# Altium project uStepperSlite.PrjPcb
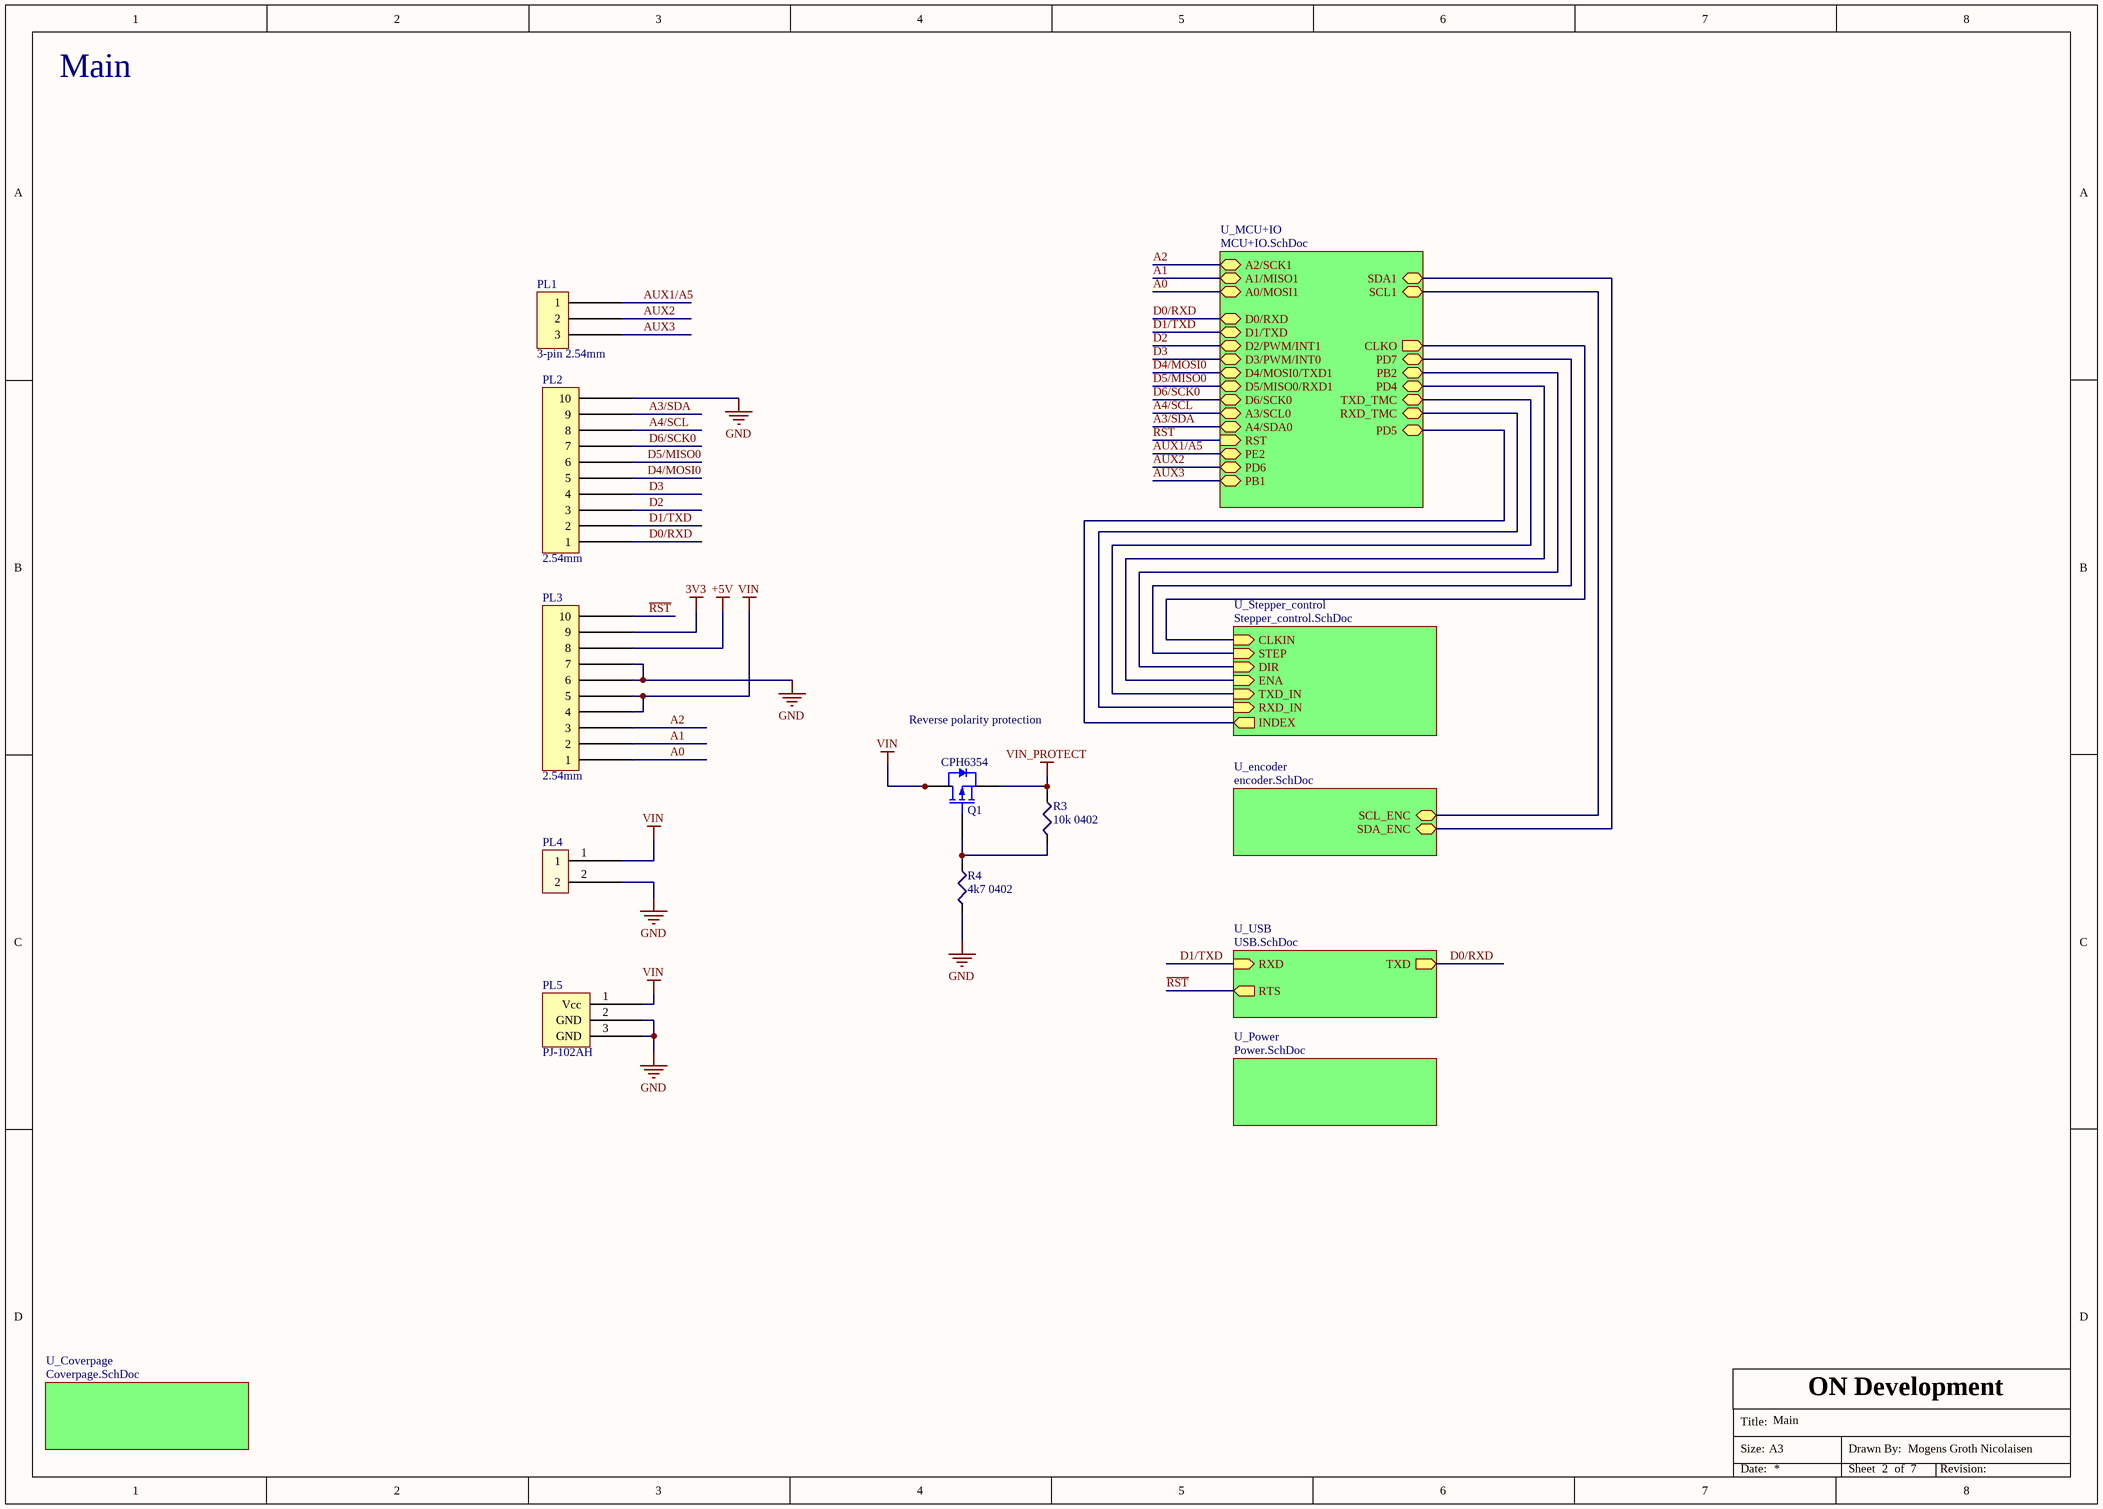
[diagram p0: Main.SchDoc]
GlobalCompanyName: ON Development; GlobalDrawnBy: Mogens Groth Nicolaisen; GlobalProjectName: uStepper S-lite; GlobalProjectRevision: 1.0
7 sheets, 84 parts. Net scope: hierarchical (ports join the sheet entries above them; power ports are global).
Board file: uStepper.PcbDoc
Sheets:
  Main.SchDoc
    U_Power = Power.SchDoc
    U_USB = USB.SchDoc
    U_Coverpage = Coverpage.SchDoc
    U_MCU+IO = MCU+IO.SchDoc
    U_Stepper_control = Stepper_control.SchDoc
    U_encoder = encoder.SchDoc

## Sheet Main.SchDoc: Main
size A3; DrawnBy: Mogens Groth Nicolaisen; DocumentNumber: 2; Revision: 1.0; SheetNumber: 2; SheetTotal: 7

### Parts
PL1  3-pin 2.54mm  [3-pin 2.54mm header]
PL2  2.54mm  [10-pin female 2.54mm]
PL3  2.54mm  [10-pin female 2.54mm]
PL4  2pin Terminal block 5.08mm  [5mm header]  (value not drawn)
PL5  PJ-102AH  [PJ-102AH]
Q1  CPH6354  [SOT95P280X95-6N]
R3  10k 0402  [RES_0402]
R4  4k7 0402  [RES_0402]

### Sub-sheets
U_Coverpage = Coverpage.SchDoc: no entries
U_encoder = encoder.SchDoc: SDA_ENC (bidir), SCL_ENC (bidir)
U_MCU+IO = MCU+IO.SchDoc: A2/SCK1 (bidir), A1/MISO1 (bidir), A0/MOSI1 (bidir), D1/TXD (bidir), D0/RXD (bidir), PB2 (bidir), CLKO (out), A4/SDA0 (bidir), A3/SCL0 (bidir), D3/PWM/INT0 (bidir), D2/PWM/INT1 (bidir), PD4 (bidir), PB1 (bidir), RST (in), TXD_TMC (bidir), RXD_TMC (bidir), SCL1 (bidir), D5/MISO0/RXD1 (bidir), D4/MOSI0/TXD1 (bidir), SDA1 (bidir), D6/SCK0 (bidir), PE2 (bidir), PD5 (bidir), PD6 (bidir), PD7 (bidir)
U_Power = Power.SchDoc: no entries
U_Stepper_control = Stepper_control.SchDoc: STEP (in), DIR (in), ENA (in), CLKIN (in), TXD_IN (in), RXD_IN (in), INDEX (out)
U_USB = USB.SchDoc: RXD (in), TXD (out), RTS (out)

### Nets
3V3: PL3.9
+5V: PL3.8
GND: PL2.10 PL3.6 PL3.7 PL4.2 PL5.2(GND) PL5.3(GND) R4.1
VIN: PL3.4 PL3.5 PL4.1 PL5.1(Vcc) Q1.1(DRAIN) Q1.2(DRAIN) Q1.5(DRAIN) Q1.6(DRAIN)
VIN_PROTECT: Q1.4(SOURCE) R3.2
~{RST}: PL3.10 ; sheet U_USB/RTS, sheet U_MCU+IO/RST
A0: PL3.1 ; sheet U_MCU+IO/A0/MOSI1
A1: PL3.2 ; sheet U_MCU+IO/A1/MISO1
A2: PL3.3 ; sheet U_MCU+IO/A2/SCK1
A3/SDA: PL2.9 ; sheet U_MCU+IO/A4/SDA0
A4/SCL: PL2.8 ; sheet U_MCU+IO/A3/SCL0
AUX1/A5: PL1.1 ; sheet U_MCU+IO/PE2
AUX2: PL1.2 ; sheet U_MCU+IO/PD6
AUX3: PL1.3 ; sheet U_MCU+IO/PB1
CLKIN: sheet U_MCU+IO/CLKO, sheet U_Stepper_control/CLKIN
D0/RXD: PL2.1 ; sheet U_USB/TXD, sheet U_MCU+IO/D0/RXD
D1/TXD: PL2.2 ; sheet U_USB/RXD, sheet U_MCU+IO/D1/TXD
D2: PL2.3 ; sheet U_MCU+IO/D2/PWM/INT1
D3: PL2.4 ; sheet U_MCU+IO/D3/PWM/INT0
D4/MOSI0: PL2.5 ; sheet U_MCU+IO/D4/MOSI0/TXD1
D5/MISO0: PL2.6 ; sheet U_MCU+IO/D5/MISO0/RXD1
D6/SCK0: PL2.7 ; sheet U_MCU+IO/D6/SCK0
DIR: sheet U_MCU+IO/PB2, sheet U_Stepper_control/DIR
ENA: sheet U_MCU+IO/PD4, sheet U_Stepper_control/ENA
INDEX: sheet U_MCU+IO/PD5, sheet U_Stepper_control/INDEX
PD7: sheet U_MCU+IO/PD7, sheet U_Stepper_control/STEP
RXD_IN: sheet U_MCU+IO/RXD_TMC, sheet U_Stepper_control/RXD_IN
SCL1: sheet U_MCU+IO/SCL1, sheet U_encoder/SCL_ENC
SDA1: sheet U_MCU+IO/SDA1, sheet U_encoder/SDA_ENC
TXD_IN: sheet U_MCU+IO/TXD_TMC, sheet U_Stepper_control/TXD_IN
NetQ1_3: Q1.3(GATE) R3.1 R4.2

### Notes on the sheet
- Reverse polarity protection
- ON Development
- Title:
- Size:
- A3
- Drawn By:
- Date:
- Sheet
- of
- Revision:

### Library data of the parts
PL1 = CMP-003-0018-1: Pin header 3-pin 2.54mm male; Mfg. Part Number: DS1021-1*3SF1-1; DynamicData: Ningbo Connfly Electric DS1021-1*3SF1-1; Cat: Connectors; LatestRevision: 1; FootprintName1: 3-pin 2.54mm header; FootprintRevisionID1: PCC-0050-2
PL2 PL3 = CMP-003-0004-2: Pin header 10-pin 2.54mm female; Mfg. Part Number: DS1023-1*10S21
PL4 = CMP-003-0002-2: PCB terminal block, angled 90°; 5mm, 2-way, 1.5mm2; Mfg. Part Number: DG301-5.0-02P-11-00A(H)
PL5 = CMP-003-0001-3: CONN PWR JACK 2X5.5MM SOLDER; Mfg. Part Number: PJ-102AH
Q1 = CMP-014-0006-2: MOSFET P-CH 60V 4A CPH6; Mfg. Part Number: CPH6354-TL-W
R3 = CMP-001-0019-3: RES SMD 10K OHM 1% 1/16W 0402; Mfg. Part Number: RMCF0402FT10K0; Case/Package: 0402; Power: 1/16 W; Tolerance: 1 %; Value: 10k
R4 = CMP-001-0029-3: RES SMD 4.7K OHM 1% 1/16W 0402; Mfg. Part Number: RC1005F472CS; Tolerance: 1; Case/Package: 0402; Power: 1/16W; Value: 4k7

## Sheet Power.SchDoc: Power
size A3; DrawnBy: Mogens Groth Nicolaisen; DocumentNumber: 5; Revision: 1.0; SheetNumber: 5; SheetTotal: 7
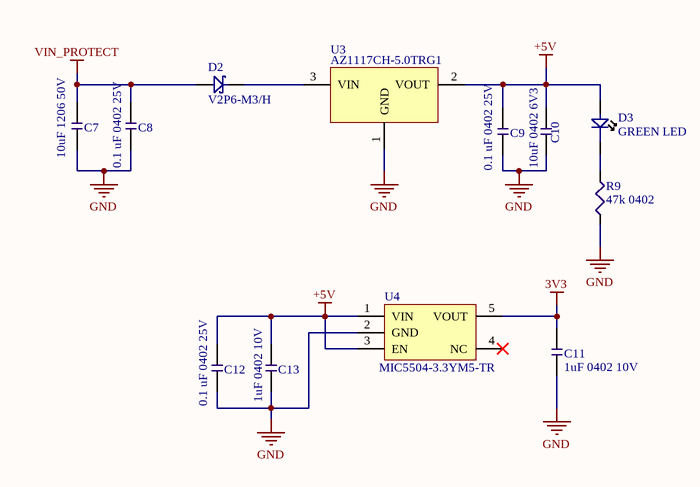
[diagram p1: Power.SchDoc]

### Parts
C7  10uF 1206 50V  [CAP_1206]
C8  0.1 uF 0402 25V  [CAP_0402]
C9  0.1 uF 0402 25V  [CAP_0402]
C10  10uF 0402 6V3  [CAP_0402]
C11  1uF 0402 10V  [CAP_0402]
C12  0.1 uF 0402 25V  [CAP_0402]
C13  1uF 0402 10V  [CAP_0402]
D2  V2P6-M3/H  [MicroSMP]
D3  GREEN LED  [0402 LED]
R9  47k 0402  [RES_0402]
U3  AZ1117CH-5.0TRG1  [SOT230P700X180-4N]
U4  MIC5504-3.3YM5-TR  [SOT95P280X130-5N]

### Nets
3V3: C11.2 U4.5(VOUT)
+5V: C9.2 C10.2 C12.2 C13.2 D3.1 U3.2(VOUT) U4.1(VIN) U4.3(EN)
GND: C7.1 C8.1 C9.1 C10.1 C11.1 C12.1 C13.1 R9.1 U3.1(GND) U4.2(GND)
VIN_PROTECT: C7.2 C8.2 D2.1
NetD2_2: D2.2 U3.3(VIN)
NetD3_2: D3.2 R9.2

Not connected (* = marked no-connect by the designer): U4 4(NC)*

### Notes on the sheet
- ON Development
- Title:
- Size:
- A3
- Drawn By:
- Date:
- Sheet
- of
- Revision:

### Library data of the parts
C7 = CMP-00030-4: 10uF 1206 50V X5R 20%; Tolerance: +/- 20%; Value: 10uF; Voltage: 50 V
C8 C9 C12 = CMP-00061-4: 0.1UF 25V 10% X5R 0402; Mfg. Part Number: TMK105BJ104KV-F; Tolerance: 10%; Value: 0.1 uF; Voltage: 25V
C10 = CMP-00011-3: 10uF 20% 0402 6V3 X6S; Current Rating: -; Tolerance: 20%; Value: 10uF; Voltage: 6V3
C11 C13 = CMP-00032-4: 1uF 0402 10V 10% X5R; Tolerance: 10 %; Value: 1 uF; Voltage: 10 V
D2 = CMP-016-0002-2: DIODE SCHOTTKY 60V 2A MICROSMP
D3 = CMP-008-0001-2: 0402 SMD LED; Mfg. Part Number: LTST-C281KGKT
R9 = CMP-001-0027-3: RES SMD 47K OHM 1% 1/16W 0402; Mfg. Part Number: RMCF0402FT47K0; Case/Package: 0402; Power: 1/16W; Tolerance: 1%; Value: 47k
U3 = CMP-00060-4: IC REG LINEAR 5V 800MA SOT223; Mfg. Part Number: AZ1117CH-5.0TRG1
U4 = CMP-00031-4: LDO Voltage Regulators Single 300mA

## Sheet USB.SchDoc: USB interface
size A3; DrawnBy: Mogens Groth Nicolaisen; DocumentNumber: 6; Revision: 1.0; SheetNumber: 6; SheetTotal: 7
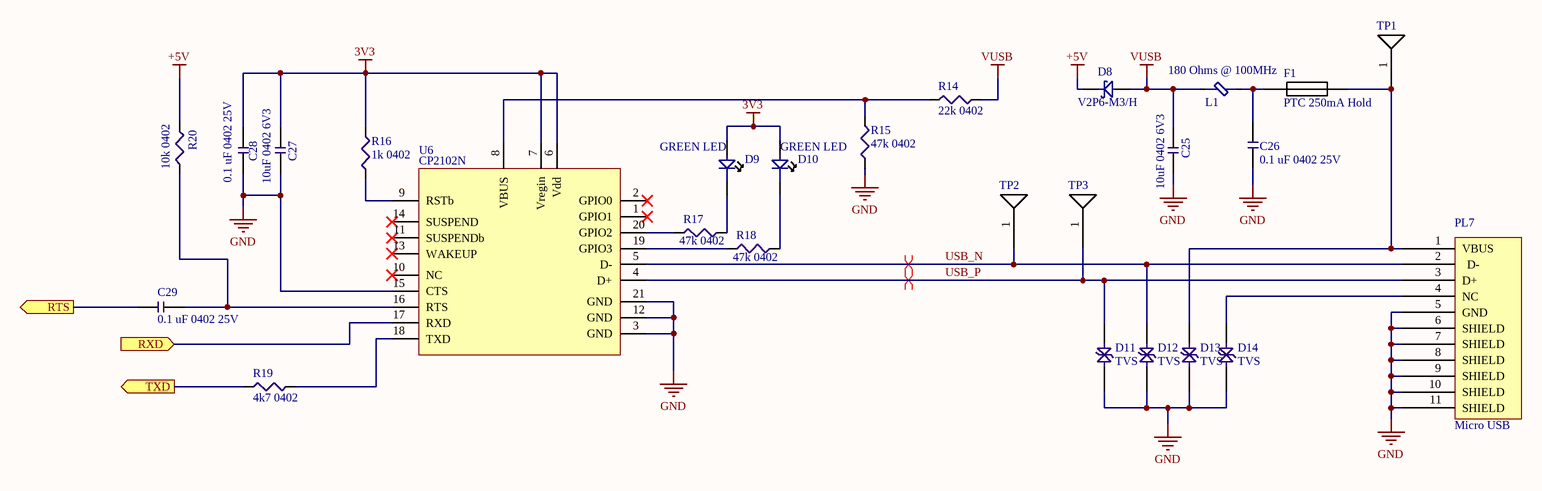
[diagram p2: USB.SchDoc]

### Parts
C25  10uF 0402 6V3  [CAP_0402]
C26  0.1 uF 0402 25V  [CAP_0402]
C27  10uF 0402 6V3  [CAP_0402]
C28  0.1 uF 0402 25V  [CAP_0402]
C29  0.1 uF 0402 25V  [CAP_0402]
D8  V2P6-M3/H  [MicroSMP]
D9  GREEN LED  [0402 LED]
D10  GREEN LED  [0402 LED]
D11  TVS  [RES_0402]
D12  TVS  [RES_0402]
D13  TVS  [RES_0402]
D14  TVS  [RES_0402]
F1  PTC 250mA Hold  [PTC Fuse 1206]
L1  180 Ohms @ 100MHz  [IND_0603]
PL7  Micro USB  [10118193-0001LF Micro USB]
R14  22k 0402  [RES_0402]
R15  47k 0402  [RES_0402]
R16  1k 0402  [RES_0402]
R17  47k 0402  [RES_0402]
R18  47k 0402  [RES_0402]
R19  4k7 0402  [RES_0402]
R20  10k 0402  [RES_0402]
TP1  TestPoint  [1x0mm]  (value not drawn)  (no BOM)
TP2  TestPoint  [1x0mm]  (value not drawn)  (no BOM)
TP3  TestPoint  [1x0mm]  (value not drawn)  (no BOM)
U6  CP2102N  [QFN50P300X300X80_HS-21N]

### Ports
RTS (out), RXD (in), TXD (out)

### Nets
3V3: C27.2 C28.2 D9.1 D10.1 R16.2 U6.6(Vdd) U6.7(Vregin)
+5V: D8.2 R20.2
GND: C25.1 C26.1 C27.1 C28.1 D11.1(Anode) D12.1(Anode) D13.1(Anode) D14.1(Anode) PL7.5(GND) PL7.6(SHIELD) PL7.7(SHIELD) PL7.8(SHIELD) PL7.9(SHIELD) PL7.10(SHIELD) PL7.11(SHIELD) R15.1 U6.3(GND) U6.12(GND) U6.15(CTS) U6.21(GND)
VUSB: C25.2 D8.1 L1.1 R14.2
~{RST}: C29.2 ; port RTS
D0/RXD: R19.2 ; port TXD
D1/TXD: U6.17(RXD) ; port RXD
USB_N: D12.2(Cathode) PL7.2(D-) TP2.1 U6.5(D-)
USB_P: D11.2(Cathode) PL7.3(D+) TP3.1 U6.4(D+)
NetC26_2: C26.2 F1.1 L1.2
NetC29_1: C29.1 R20.1 U6.16(RTS)
NetD9_2: D9.2 R17.1
NetD10_2: D10.2 R18.1
NetD13_2: D13.2(Cathode) F1.2 PL7.1(VBUS) TP1.1
NetD14_2: D14.2(Cathode) PL7.4(NC)
NetR14_1: R14.1 R15.2 U6.8(VBUS)
NetR16_1: R16.1 U6.9(RSTb)
NetR17_2: R17.2 U6.20(GPIO2)
NetR18_2: R18.2 U6.19(GPIO3)
NetR19_1: R19.1 U6.18(TXD)

Not connected (* = marked no-connect by the designer): U6 1(GPIO1)* 2(GPIO0)* 10(NC)* 11(SUSPENDb)* 13(WAKEUP)* 14(SUSPEND)*

### Layout directives
differential pair: USB_N, USB_P

### Notes on the sheet
- ON Development
- Title:
- Size:
- A3
- Drawn By:
- Date:
- Sheet
- of
- Revision:

### Library data of the parts
C25 C27 = CMP-00011-3: 10uF 20% 0402 6V3 X6S; Current Rating: -; Tolerance: 20%; Value: 10uF; Voltage: 6V3
C26 C28 C29 = CMP-00061-4: as C8 on sheet Power; Tolerance: 10%; Value: 0.1 uF; Voltage: 25V
D8 = CMP-016-0002-2: DIODE SCHOTTKY 60V 2A MICROSMP
D9 D10 = CMP-008-0001-2: as D3 on sheet Power
D11-D14 = CMP-016-0004-2: TVS DIODE 12VC 8A IPP 0402; Mfg. Part Number: GG040205100N2P
F1 = CMP-017-0000-3: PTC RESET FUSE 24V 250MA 1206; Mfg. Part Number: 0ZCJ0025AF2E; Case/Package: 1206; Mount: SMD; Pins: 2; RoHS: Yes
L1 = CMP-ROOT-0005-2: FERRITE BEAD 180 OHM 0603 1LN; Mfg. Part Number: BLM18PG181SN1D; Current: 1.5A; Value: 180 Ohm; Case/Package: 0603
PL7 = CMP-003-0000-3: CONN USB MICRO B RECPT SMT R/A; Mfg. Part Number: 10118193-0001LF
R14 = CMP-001-0026-3: RES SMD 22K OHM 1% 1/16W 0402; Mfg. Part Number: RMCF0402FT22K0; Case/Package: 0402; Power: 1/16W; Tolerance: 1%; Value: 22k
R15 R17 R18 = CMP-001-0027-3: as R9 on sheet Power; Case/Package: 0402; Power: 1/16W; Tolerance: 1%; Value: 47k
R16 = CMP-001-0025-3: RES SMD 1K OHM 1% 1/16W 0402; Mfg. Part Number: CRG0402F1K0; Case/Package: 0402; Power: 1/16W; Tolerance: 1%; Value: 1k
R19 = CMP-001-0029-3: as R4 on sheet Main; Case/Package: 0402; Power: 1/16W; Value: 4k7
R20 = CMP-001-0019-3: as R3 on sheet Main; Case/Package: 0402; Power: 1/16 W; Tolerance: 1 %; Value: 10k
TP1-TP3 = CMP-ROOT-0006-0.0
U6 = CMP-00038-5: IC BRIDGE USB TO UART 20QFN; Mfg. Part Number: CP2102N-A01-GQFN20

## Sheet Coverpage.SchDoc: uStepper S-lite
size A3; DrawnBy: Mogens Groth Nicolaisen; DocumentNumber: 1; Revision: 1.0; SheetNumber: 1; SheetTotal: 7
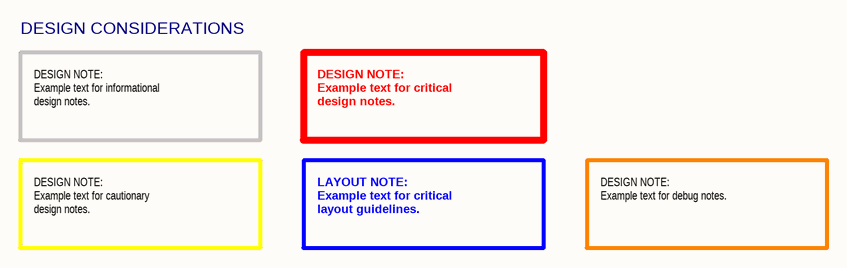
[diagram p3: Coverpage.SchDoc]

### Notes on the sheet
- DESIGN CONSIDERATIONS
- DESIGN NOTE:
  Example text for informational
  design notes.
- DESIGN NOTE:
  Example text for critical
  design notes.
- DESIGN NOTE:
  Example text for cautionary
  design notes.
- LAYOUT NOTE:
  Example text for critical
  layout guidelines.
- DESIGN NOTE:
  Example text for debug notes.
- ON Development
- Title:
- Size:
- A3
- Drawn By:
- Date:
- Sheet
- of
- Revision:

## Sheet MCU+IO.SchDoc: MCU
size A3; DrawnBy: Mogens Groth Nicolaisen; DocumentNumber: 3; Revision: 1.0; SheetNumber: 3; SheetTotal: 7
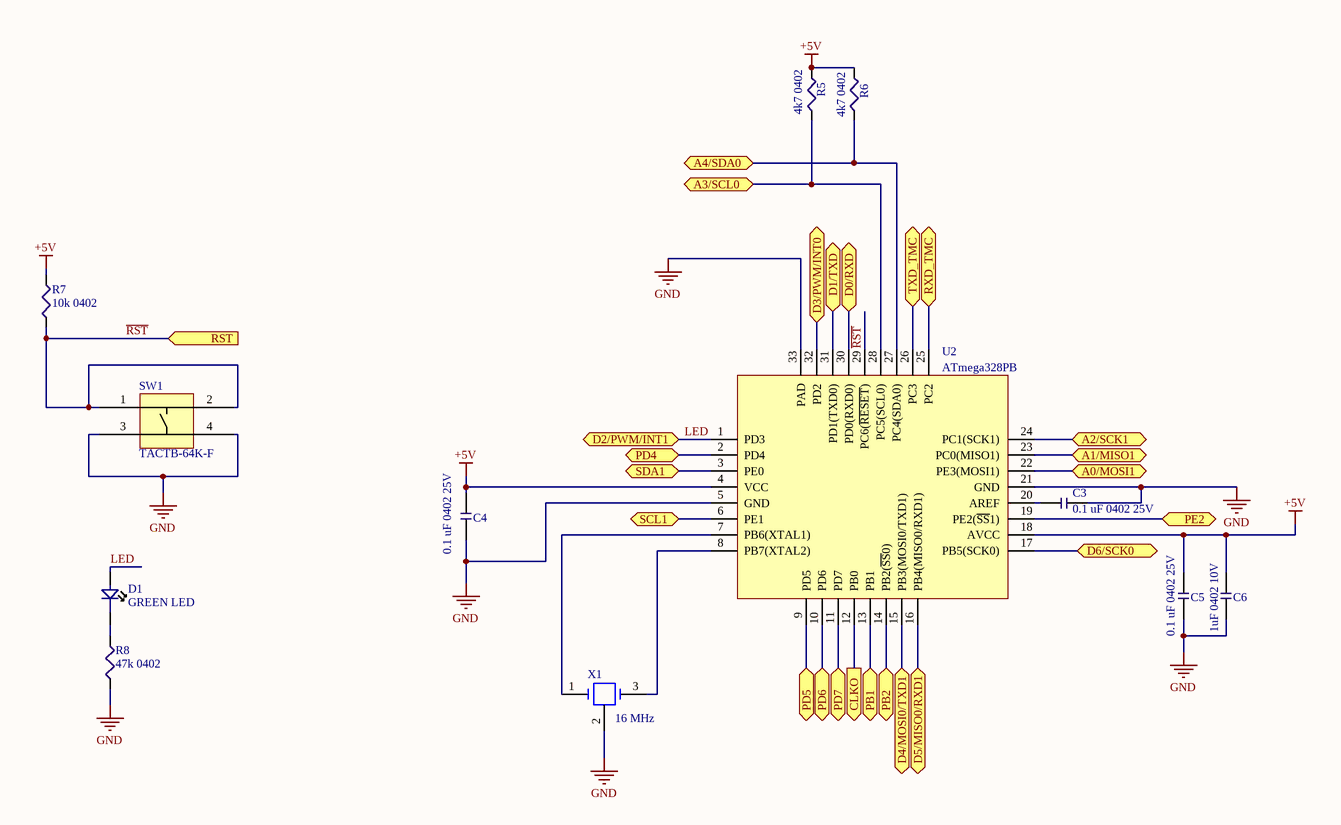
[diagram p4: MCU+IO.SchDoc]

### Parts
C3  0.1 uF 0402 25V  [CAP_0402]
C4  0.1 uF 0402 25V  [CAP_0402]
C5  0.1 uF 0402 25V  [CAP_0402]
C6  1uF 0402 10V  [CAP_0402]
D1  GREEN LED  [0402 LED]
R5  4k7 0402  [RES_0402]
R6  4k7 0402  [RES_0402]
R7  10k 0402  [RES_0402]
R8  47k 0402  [RES_0402]
SW1  TACTB-64K-F  [TACTB-64K-F]
U2  ATmega328PB  [QFN50P500X500X90_HS-33N]
X1  16 MHz  [CSTCE16XTAL]

### Ports
A0/MOSI1 (bidir), A1/MISO1 (bidir), A2/SCK1 (bidir), A3/SCL0 (bidir), A4/SDA0 (bidir), CLKO (out), D0/RXD (bidir), D1/TXD (bidir), D2/PWM/INT1 (bidir), D3/PWM/INT0 (bidir), D4/MOSI0/TXD1 (bidir), D5/MISO0/RXD1 (bidir), D6/SCK0 (bidir), PB1 (bidir), PB2 (bidir), PD4 (bidir), PD5 (bidir), PD6 (bidir), PD7 (bidir), PE2 (bidir), RST (in), RXD_TMC (bidir), SCL1 (bidir), SDA1 (bidir), TXD_TMC (bidir)

### Nets
+5V: C4.1 C5.2 C6.2 R5.2 R6.2 R7.2 U2.4(VCC) U2.18(AVCC)
GND: C3.1 C4.2 C5.1 C6.1 R8.1 SW1.3 SW1.4 U2.5(GND) U2.21(GND) U2.33(PAD) X1.2(GND)
~{RST}: R7.1 SW1.1 SW1.2 U2.29(PC6(~{RESET})) ; port RST
A0: U2.22(PE3(MOSI1)) ; port A0/MOSI1
A1: U2.23(PC0(MISO1)) ; port A1/MISO1
A2: U2.24(PC1(SCK1)) ; port A2/SCK1
A3/SDA: R6.1 U2.27(PC4(SDA0)) ; port A4/SDA0
A4/SCL: R5.1 U2.28(PC5(SCL0)) ; port A3/SCL0
AUX1/A5: U2.19(PE2(~{SS}1)) ; port PE2
AUX2: U2.10(PD6) ; port PD6
AUX3: U2.13(PB1) ; port PB1
CLKIN: U2.12(PB0) ; port CLKO
D0/RXD: U2.30(PD0(RXD0)) ; port D0/RXD
D1/TXD: U2.31(PD1(TXD0)) ; port D1/TXD
D3: U2.32(PD2) ; port D3/PWM/INT0
D4/MOSI0: U2.15(PB3(MOSI0/TXD1)) ; port D4/MOSI0/TXD1
D5/MISO0: U2.16(PB4(MISO0/RXD1)) ; port D5/MISO0/RXD1
D6/SCK0: U2.17(PB5(SCK0)) ; port D6/SCK0
DIR: U2.14(PB2(~{SS}0)) ; port PB2
ENA: U2.2(PD4) ; port PD4
INDEX: U2.9(PD5) ; port PD5
LED: D1.1 U2.1(PD3) ; port D2/PWM/INT1  [project net D2]
PD7: U2.11(PD7) ; port PD7
RXD_IN: U2.25(PC2) ; port RXD_TMC
SCL1: U2.6(PE1) ; port SCL1
SDA1: U2.3(PE0) ; port SDA1
TXD_IN: U2.26(PC3) ; port TXD_TMC
NetC3_2: C3.2 U2.20(AREF)
NetD1_2: D1.2 R8.2
NetU2_7: U2.7(PB6(XTAL1)) X1.1(OSC1)
NetU2_8: U2.8(PB7(XTAL2)) X1.3(OSC2)

### Notes on the sheet
- ON Development
- Title:
- Size:
- A3
- Drawn By:
- Date:
- Sheet
- of
- Revision:

### Library data of the parts
C3-C5 = CMP-00061-4: as C8 on sheet Power; Tolerance: 10%; Value: 0.1 uF; Voltage: 25V
C6 = CMP-00032-4: 1uF 0402 10V 10% X5R; Tolerance: 10 %; Value: 1 uF; Voltage: 10 V
D1 = CMP-008-0001-2: as D3 on sheet Power
R5 R6 = CMP-001-0029-3: as R4 on sheet Main; Case/Package: 0402; Power: 1/16W; Value: 4k7
R7 = CMP-001-0019-3: as R3 on sheet Main; Case/Package: 0402; Power: 1/16 W; Tolerance: 1 %; Value: 10k
R8 = CMP-001-0027-3: as R9 on sheet Power; Case/Package: 0402; Power: 1/16W; Tolerance: 1%; Value: 47k
SW1 = CMP-013-0002-1: Microswitch TACT; SPST-NO; Positions:2; 0.05A/12VDC;; Case/Package: -; Mount: SMD; Pins: 4; RoHS: Yes; Mfg. Part No.: TACTB-64K-F
U2 = CMP-011-0001-4: IC MCU 8BIT 32KB FLASH 32TQFP; Case/Package: QFN-32; Mount: SMD; Pins: 32; RoHS: Yes
X1 = CMP-015-0002-4: CER RES 16.0000MHZ 15PF SMD; Mfg. Part Number: CSTCE16M0V53-R0; FootprintName1: CSTCE16XTAL; FootprintDescription1: CSTCE16M0V53-R0; FootprintRevisionID1: PCC-0038-1; Case/Package: -; Mount: SMD; Pins: 3; RoHS: Yes

## Sheet Stepper_control.SchDoc: Stepper Control
size A3; DrawnBy: Mogens Groth Nicolaisen; DocumentNumber: 4; Revision: 1.0; SheetNumber: 4; SheetTotal: 7
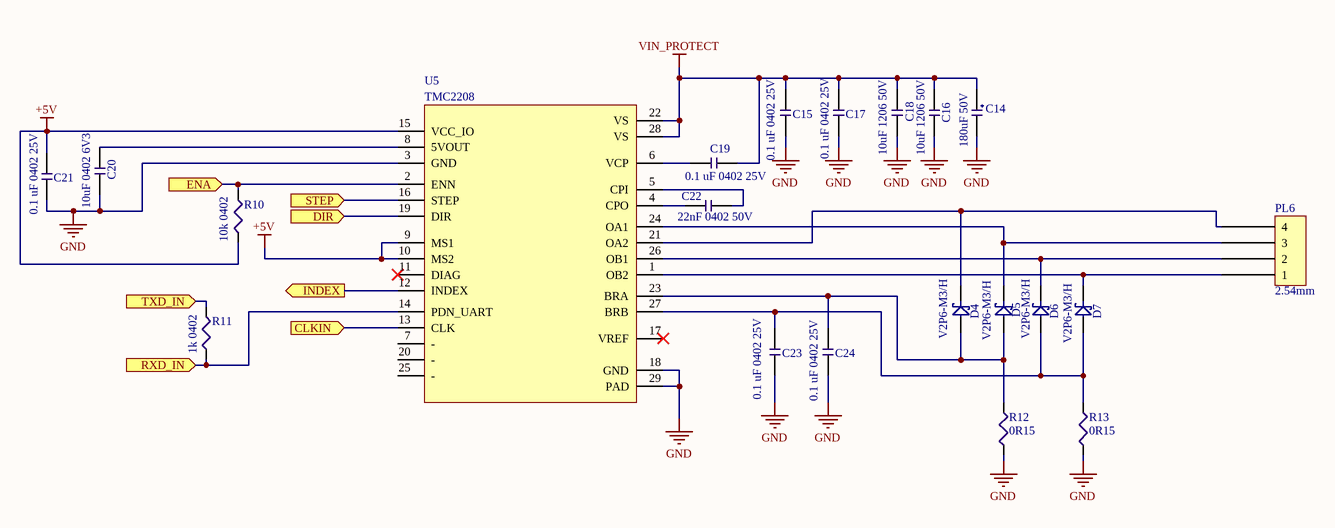
[diagram p5: Stepper_control.SchDoc]

### Parts
C14  180uF 50V  [Capacitor 8x22]
C15  0.1 uF 0402 25V  [CAP_0402]
C16  10uF 1206 50V  [CAP_1206]
C17  0.1 uF 0402 25V  [CAP_0402]
C18  10uF 1206 50V  [CAP_1206]
C19  0.1 uF 0402 25V  [CAP_0402]
C20  10uF 0402 6V3  [CAP_0402]
C21  0.1 uF 0402 25V  [CAP_0402]
C22  22nF 0402 50V  [CAP_0402]
C23  0.1 uF 0402 25V  [CAP_0402]
C24  0.1 uF 0402 25V  [CAP_0402]
D4  V2P6-M3/H  [MicroSMP]
D5  V2P6-M3/H  [MicroSMP]
D6  V2P6-M3/H  [MicroSMP]
D7  V2P6-M3/H  [MicroSMP]
PL6  2.54mm  [4-pin 2.54mm header]
R10  10k 0402  [RES_0402]
R11  1k 0402  [RES_0402]
R12  0R15  [RES_1206]
R13  0R15  [RES_1206]
U5  TMC2208  [QFN50P500X500X90_HS-29N]

### Ports
CLKIN (in), DIR (in), ENA (in), INDEX (out), RXD_IN (in), STEP (in), TXD_IN (in)

### Nets
+5V: C21.2 R10.2 U5.9(MS1) U5.10(MS2) U5.15(VCC_IO)
GND: C14.2 C15.1 C16.2 C17.1 C18.2 C20.1 C21.1 C23.1 C24.1 R12.1 R13.1 U5.3(GND) U5.18(GND) U5.29(PAD)
VIN_PROTECT: C14.1 C15.2 C16.1 C17.2 C18.1 C19.1 U5.22(VS) U5.28(VS)
CLKIN: U5.13(CLK) ; port CLKIN
DIR: U5.19(DIR) ; port DIR
ENA: R10.1 U5.2(ENN) ; port ENA
INDEX: U5.12(INDEX) ; port INDEX
PD7: U5.16(STEP) ; port STEP
RXD_IN: R11.1 U5.14(PDN_UART) ; port RXD_IN
TXD_IN: R11.2 ; port TXD_IN
NetC19_2: C19.2 U5.6(VCP)
NetC20_2: C20.2 U5.8(5VOUT)
NetC22_1: C22.1 U5.4(CPO)
NetC22_2: C22.2 U5.5(CPI)
NetC23_2: C23.2 D6.1 D7.1 R13.2 U5.27(BRB)
NetC24_2: C24.2 D4.1 D5.1 R12.2 U5.23(BRA)
NetD4_2: D4.2 PL6.4 U5.21(OA2)
NetD5_2: D5.2 PL6.3 U5.24(OA1)
NetD6_2: D6.2 PL6.2 U5.26(OB1)
NetD7_2: D7.2 PL6.1 U5.1(OB2)

Not connected (* = marked no-connect by the designer): U5 7(-) 11(DIAG)* 17(VREF)* 20(-) 25(-)

### Notes on the sheet
- ON Development
- Title:
- Size:
- A3
- Drawn By:
- Date:
- Sheet
- of
- Revision:

### Library data of the parts
C14 = CMP-002-0003-2: 180UF 20% 50V 105DEG RADIAL; Tolerance: 20%; Value: 180uF; Case/Package: -
C15 C17 C19 C21 C23 C24 = CMP-00061-4: as C8 on sheet Power; Tolerance: 10%; Value: 0.1 uF; Voltage: 25V
C16 C18 = CMP-00030-4: as C7 on sheet Power; Value: 10uF; Voltage: 50 V
C20 = CMP-00011-3: 10uF 20% 0402 6V3 X6S; Current Rating: -; Tolerance: 20%; Value: 10uF; Voltage: 6V3
C22 = CMP-00045-4: 22nF 0402 50V X7R 10%; Mfg. Part Number: 885012205063; Tolerance: 10%; Value: 22nF; Voltage: 50V
D4-D7 = CMP-016-0002-2: DIODE SCHOTTKY 60V 2A MICROSMP
PL6 = CMP-003-0003-3: Pin header 4-pin 2.54mm male; Mfg. Part Number: DS1021-1*4SF1-1
R10 = CMP-001-0019-3: as R3 on sheet Main; Case/Package: 0402; Power: 1/16 W; Tolerance: 1 %; Value: 10k
R11 = CMP-001-0025-3: as R16 on sheet USB; Case/Package: 0402; Power: 1/16W; Tolerance: 1%; Value: 1k
R12 R13 = CMP-001-0039-2: RES 0.15 OHM 1% 1/2W 1206; Mfg. Part Number: RL1206FR-7W0R15L; Power: 0.5W; FootprintName1: RES_1206; FootprintDescription1: Chip Resistor, 2-Leads, 1206, IPC Medium Density; FootprintRevisionID1: RES_1206-1; Tolerance: 1%; Value: 0R15; Case/Package: 1206
U5 = CMP-00063-3: IC STEPPER MOTOR DRIVER 28QFN; Mfg. Part Number: TMC2208-LA-T

## Sheet encoder.SchDoc: Encoder
size A3; DrawnBy: Mogens Groth Nicolaisen; DocumentNumber: 7; Revision: 1.0; SheetNumber: 7; SheetTotal: 7
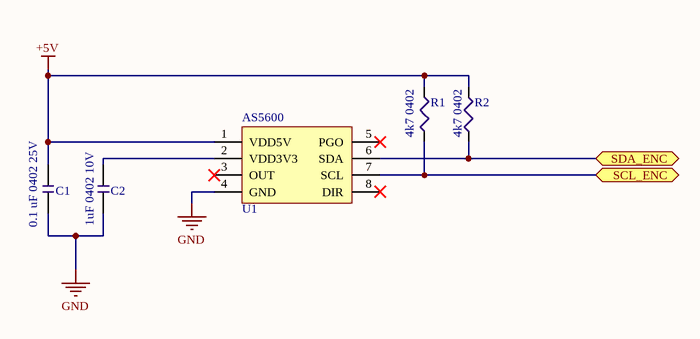
[diagram p6: encoder.SchDoc]

### Parts
C1  0.1 uF 0402 25V  [CAP_0402]
C2  1uF 0402 10V  [CAP_0402]
R1  4k7 0402  [RES_0402]
R2  4k7 0402  [RES_0402]
U1  AS5600  [AS5600_SOIC8]

### Ports
SCL_ENC (bidir), SDA_ENC (bidir)

### Nets
+5V: C1.2 R1.2 R2.2 U1.1(VDD5V)
GND: C1.1 C2.1 U1.4(GND)
SCL1: R1.1 U1.7(SCL) ; port SCL_ENC
SDA1: R2.1 U1.6(SDA) ; port SDA_ENC
NetC2_2: C2.2 U1.2(VDD3V3)

Not connected (* = marked no-connect by the designer): U1 3(OUT)* 5(PGO)* 8(DIR)*

### Notes on the sheet
- ON Development
- Title:
- Size:
- A3
- Drawn By:
- Date:
- Sheet
- of
- Revision:

### Library data of the parts
C1 = CMP-00061-4: as C8 on sheet Power; Tolerance: 10%; Value: 0.1 uF; Voltage: 25V
C2 = CMP-00032-4: 1uF 0402 10V 10% X5R; Tolerance: 10 %; Value: 1 uF; Voltage: 10 V
R1 R2 = CMP-001-0029-3: as R4 on sheet Main; Case/Package: 0402; Power: 1/16W; Value: 4k7
U1 = CMP-00062-3: IC SENSOR MAG ROTARY 12BIT 8SOIC; Mfg. Part Number: AS5600-ASOT

## Nets that join several sheets
3V3: Main (PL3.9), Power (C11.2 U4.5), USB (7 pins)
+5V: Main (PL3.8), Power (8 pins), USB (D8.2 R20.2), MCU+IO (8 pins), Stepper_control (5 pins), encoder (C1.2 R1.2 R2.2 U1.1)
GND: Main (7 pins), Power (10 pins), USB (20 pins), MCU+IO (11 pins), Stepper_control (14 pins), encoder (C1.1 C2.1 U1.4)
VIN_PROTECT: Main (Q1.4 R3.2), Power (C7.2 C8.2 D2.1), Stepper_control (8 pins)
~{RST}: Main (PL3.10), USB (C29.2), MCU+IO (R7.1 SW1.1 SW1.2 U2.29)
A0: Main (PL3.1), MCU+IO (U2.22)
A1: Main (PL3.2), MCU+IO (U2.23)
A2: Main (PL3.3), MCU+IO (U2.24)
A3/SDA: Main (PL2.9), MCU+IO (R6.1 U2.27)
A4/SCL: Main (PL2.8), MCU+IO (R5.1 U2.28)
AUX1/A5: Main (PL1.1), MCU+IO (U2.19)
AUX2: Main (PL1.2), MCU+IO (U2.10)
AUX3: Main (PL1.3), MCU+IO (U2.13)
CLKIN: MCU+IO (U2.12), Stepper_control (U5.13)
D0/RXD: Main (PL2.1), USB (R19.2), MCU+IO (U2.30)
D1/TXD: Main (PL2.2), USB (U6.17), MCU+IO (U2.31)
D2: Main (PL2.3), MCU+IO (D1.1 U2.1)
D3: Main (PL2.4), MCU+IO (U2.32)
D4/MOSI0: Main (PL2.5), MCU+IO (U2.15)
D5/MISO0: Main (PL2.6), MCU+IO (U2.16)
D6/SCK0: Main (PL2.7), MCU+IO (U2.17)
DIR: MCU+IO (U2.14), Stepper_control (U5.19)
ENA: MCU+IO (U2.2), Stepper_control (R10.1 U5.2)
INDEX: MCU+IO (U2.9), Stepper_control (U5.12)
PD7: MCU+IO (U2.11), Stepper_control (U5.16)
RXD_IN: MCU+IO (U2.25), Stepper_control (R11.1 U5.14)
SCL1: MCU+IO (U2.6), encoder (R1.1 U1.7)
SDA1: MCU+IO (U2.3), encoder (R2.1 U1.6)
TXD_IN: MCU+IO (U2.26), Stepper_control (R11.2)

## Assembly variants
Screw: not fitted PL5 PL7 R3 R4
Plug: not fitted PL4 PL7 R3 R4
Default: not fitted PL4 PL7 R3 R4